# Altium schematic sheet IR POWER STAGE.SchDoc
size A4; DocumentNumber: 7; SheetNumber: ALT0056; SheetTotal: 21
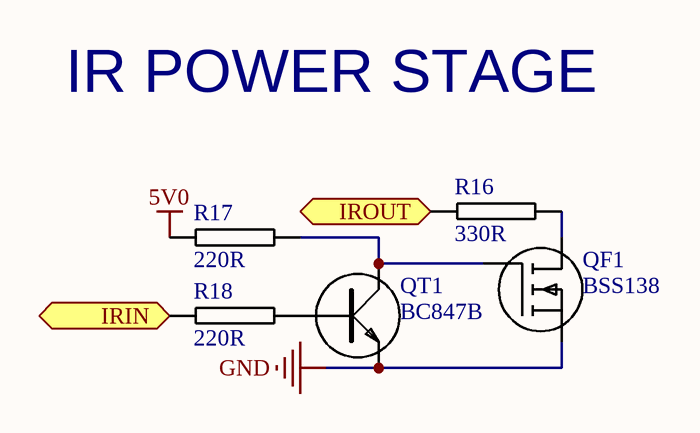
[diagram p0: IR POWER STAGE.SchDoc]

## Parts
QF1  BSS138  [SOT23-GDS]
QT1  BC847B  [SOT23-BCE]
R16  330R  [0805R-330]
R17  220R  [0805R-220]
R18  220R  [0805R-220]

## Ports
IRIN (in), IROUT (out)

## Nets
5V0: R17.1
GND: QF1.S QT1.E
IRIN: R18.1 ; port IRIN
IROUT: R16.1 ; port IROUT
NetQF1_D: QF1.D R16.2
NetQF1_G: QF1.G QT1.C R17.2
NetQT1_B: QT1.B R18.2

## Notes on the sheet
- IR POWER STAGE
- Title
- Size:
- Date:
- A4
- Number:
- Time:
- Revision:
- Sheet
- of
- File:

## Library data of the parts
QF1 = BSS138-SOT23: N CHANNEL MOSFET BSS138 SOT23; Manufacturer: Fairchild Semiconductor; Manufacturer Part Number: 2N7002; Drain to Source Voltage (Vdss): 60V; Vgs(th) (Max) @ Id: 2.5V @ 250µA; Power - Max: 200mW; Current - Continuous Drain (Id) @ 25° C: 115mA; Rds On (Max) @ Id, Vgs: 7.5 Ohm @ 500mA, 10V; FET Type: MOSFET N-Channel, Metal Oxide; FET Feature: Logic Level Gate; Input Capacitance (Ciss) @ Vds: 50pF @ 25V; Reel: Q2; Supplier 1: Digi-Key; Supplier Part Number 1: 2N7002NTR-ND; Package / Case: SOT-23-3, TO-236-3, Micro3™, SSD3, SST3; RoHS: RoHS Compliant; Mounting Type: Surface Mount; Packaging: Tape & Reel (TR); Gate Charge (Qg) @ Vgs: -; Supplier Part Number: 2N7002NTR-ND; Supplier: Digi-Key; Category: Discrete Semiconductor Products
QT1 = BC847: BC847 SMALL SIGNAL NPN TRANSISTOR; Manufacturer Part Number: BC847BMTF; Manufacturer: Fairchild Semiconductor; Current - Collector (Ic) (Max): 100mA; Frequency - Transition: 300MHz; Vce Saturation (Max) @ Ib, Ic: 200mV @ 5mA, 100mA; Voltage - Collector Emitter Breakdown (Max): 45V; Power - Max: 310mW; DC Current Gain (hFE) (Min) @ Ic, Vce: 200 @ 2mA, 5V; Supplier 1: Digi-Key; Supplier Part Number 1: BC847BMTFCT-ND; RoHS: RoHS Compliant; Transistor Type: NPN; Mounting Type: Surface Mount; Packaging: Cut Tape (CT); Package / Case: SOT-23-3, TO-236-3, Micro3™, SSD3, SST3; Current - Collector Cutoff (Max): -; Supplier: Digi-Key; Category: Discrete Semiconductor Products; Supplier Part Number: BC847BMTFCT-ND
R16 = 0805R-330: RESISTOR 0805 1/4 WATT THIN FILM; Reel: *
R17 R18 = 0805R-220: RESISTOR 0805 1/4 WATT THIN FILM; Reel: *